# EAGLE schematic Stepper Driver v2 (EAGLE 5.02)
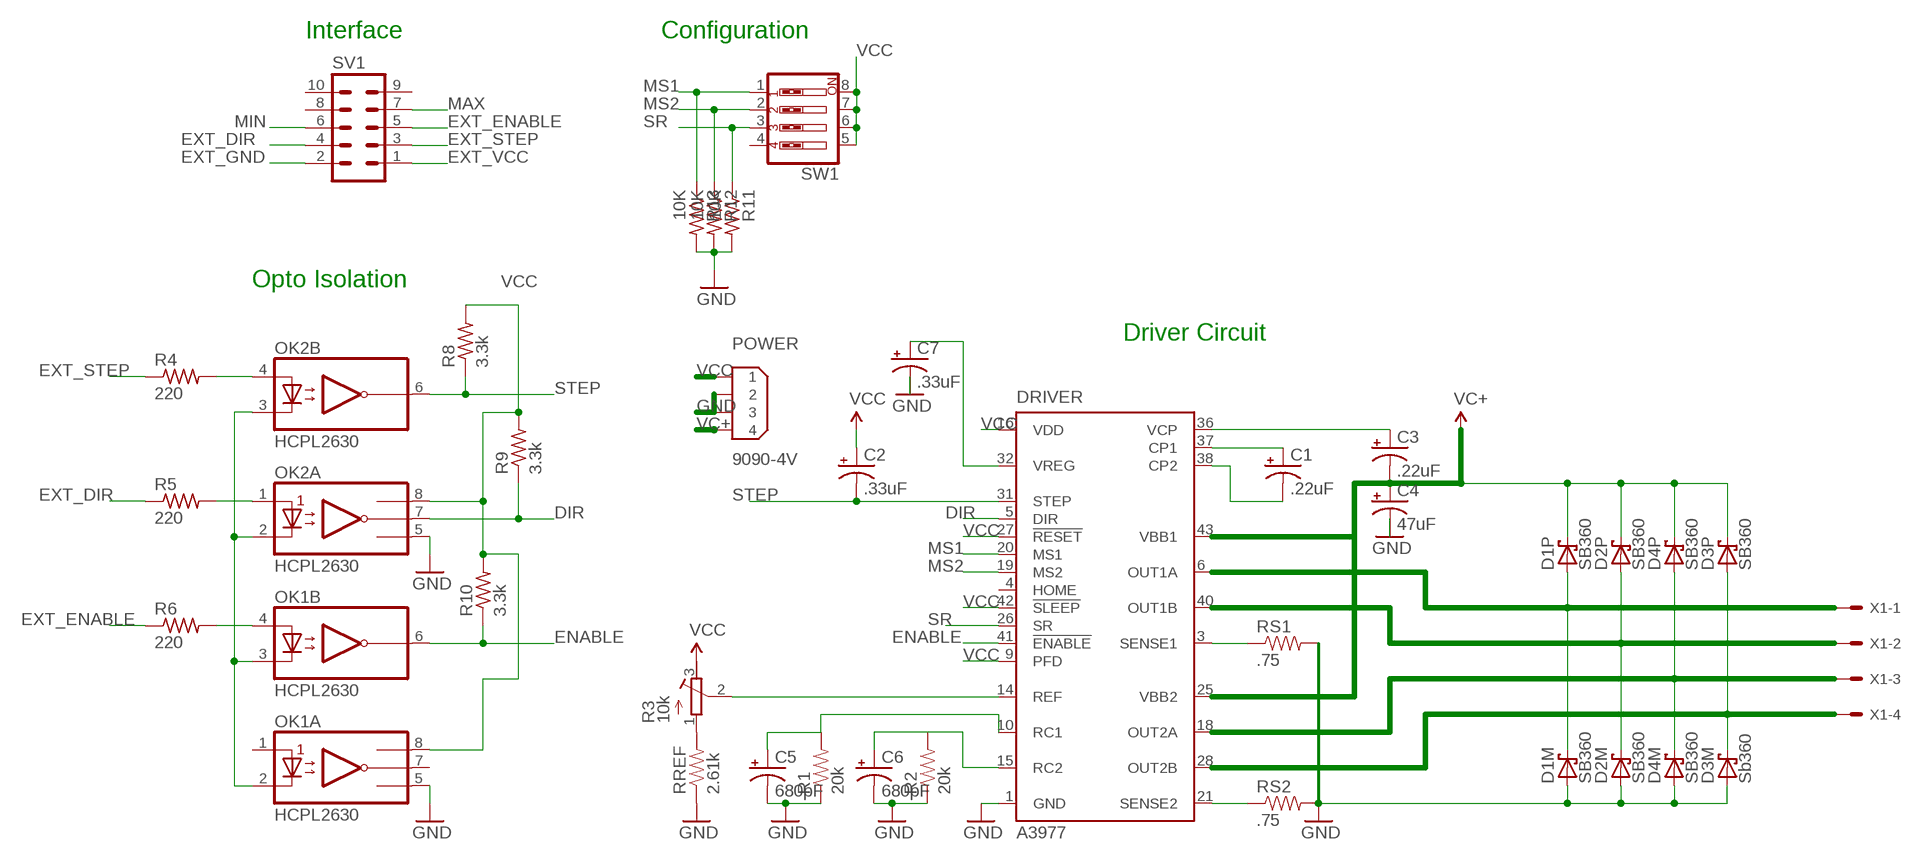
[diagram p0: schematic, sheet 1]

## Parts
C1  .22uF  CAP_POLPTH2  [CPOL-RADIAL-10UF-25V]
C2  .33uF  CAP_POLPTH2  [CPOL-RADIAL-10UF-25V]
C3  .22uF  CAP_POLPTH2  [CPOL-RADIAL-10UF-25V]
C4  47uF  CAP_POLPTH1  [CPOL-RADIAL-100UF-25V]
C5  680pF  CAP_POLPTH2  [CPOL-RADIAL-10UF-25V]
C6  680pF  CAP_POLPTH2  [CPOL-RADIAL-10UF-25V]
C7  .33uF  CAP_POLPTH2  [CPOL-RADIAL-10UF-25V]
D1M  SB360  SCHOTTKY-DIODECB429-15  [CB429-15]
D1P  SB360  SCHOTTKY-DIODECB429-15  [CB429-15]
D2M  SB360  SCHOTTKY-DIODECB429-15  [CB429-15]
D2P  SB360  SCHOTTKY-DIODECB429-15  [CB429-15]
D3M  Sb360  SCHOTTKY-DIODECB429-15  [CB429-15]
D3P  SB360  SCHOTTKY-DIODECB429-15  [CB429-15]
D4M  SB360  SCHOTTKY-DIODECB429-15  [CB429-15]
D4P  SB360  SCHOTTKY-DIODECB429-15  [CB429-15]
DRIVER  A3977  [PLCC44]
OK1  HCPL2630  [DIL08]
OK2  HCPL2630  [DIL08]
POWER  9090-4V  [9090-4V]
R1  20k  RESISTORPTH1  [AXIAL-0.3]
R2  20k  RESISTORPTH1  [AXIAL-0.3]
R3  10k  R-TRIMM3339P  [RTRIM3339P]
R4  220  R-US_0207/2V  [0207/2V]
R5  220  R-US_0207/2V  [0207/2V]
R6  220  R-US_0207/2V  [0207/2V]
R8  3.3k  R-US_0207/2V  [0207/2V]
R9  3.3k  R-US_0207/2V  [0207/2V]
R10  3.3k  R-US_0207/2V  [0207/2V]
R11  10K  R-US_0207/7  [0207/7]
R12  10K  R-US_0207/7  [0207/7]
R13  10K  R-US_0207/7  [0207/7]
RREF  2.61k  RESISTORPTH1  [AXIAL-0.3]
RS1  .75  RESISTORPTH1  [AXIAL-0.3]
RS2  .75  RESISTORPTH1  [AXIAL-0.3]
SV1  ML10  [ML10]
SW1  SW_DIP-4  [EDG-04]
X1  KK-156-4  [KK-156-4]

## Nets
DIR: DRIVER.5(DIR) OK2.7(A:VO1) R9.1
ENABLE: DRIVER.41(!ENABLE) OK1.6(B:VO2) R10.1
EXT_DIR: R5.1 SV1.4
EXT_ENABLE: R6.1 SV1.5
EXT_GND: SV1.2
EXT_STEP: R4.1 SV1.3
EXT_VCC: SV1.1
GND: C4.2(-) C5.2(-) C6.2(-) C7.2(-) D1M.A D2M.A D3M.A D4M.A DRIVER.1(GND) OK1.5(A:GND) OK2.5(A:GND) POWER.2 POWER.3 R1.P$1 R2.P$1 R11.2 R12.2 R13.2 RREF.P$1 RS1.P$2 RS2.P$2
MAX: SV1.7
MIN: SV1.6
MS1: DRIVER.20(MS1) R13.1 SW1.1
MS2: DRIVER.19(MS2) R12.1 SW1.2
N$1: C7.1(+) DRIVER.32(VREG)
N$2: DRIVER.21(SENSE2) RS2.P$1
N$3: DRIVER.3(SENSE1) RS1.P$1
N$4 [Power]: C3.1(+) DRIVER.36(VCP)
N$5: C1.1(+) DRIVER.37(CP1)
N$6: C1.2(-) DRIVER.38(CP2)
N$7: C5.1(+) DRIVER.10(RC1) R1.P$2
N$9: R3.1(E) RREF.P$2
N$10: OK1.2(A:C1) OK1.3(B:C2) OK2.2(A:C1) OK2.3(B:C2)
N$11: C6.1(+) DRIVER.15(RC2) R2.P$2
N$12: OK2.4(B:A2) R4.2
N$13: DRIVER.14(REF) R3.2(S)
N$15: OK2.1(A:A1) R5.2
N$16 [Power]: D1M.C D1P.A DRIVER.6(OUT1A) X1.1
N$18: OK1.4(B:A2) R6.2
N$19 [Power]: D3M.C D3P.A DRIVER.28(OUT2B) X1.4
N$25: D4M.C D4P.A DRIVER.18(OUT2A) X1.3
N$28 [Power]: D2M.C D2P.A DRIVER.40(OUT1B) X1.2
SR: DRIVER.26(SR) R11.1 SW1.3
STEP: C2.2(-) DRIVER.31(STEP) OK2.6(B:VO2) R8.1
VC+ [Power]: C3.2(-) C4.1(+) D1P.C D2P.C D3P.C D4P.C DRIVER.25(VBB2) DRIVER.43(VBB1) POWER.4
VCC: C2.1(+) DRIVER.9(PFD) DRIVER.16(VDD) DRIVER.27(!RESET) DRIVER.42(!SLEEP) OK1.8(A:VCC) OK2.8(A:VCC) POWER.1 R3.3(A) R8.2 R9.2 R10.2 SW1.5 SW1.6 SW1.7 SW1.8
Unconnected: DRIVER.4(HOME) OK1.1(A:A1) OK1.7(A:VO1) SV1.8 SV1.9 SV1.10 SW1.4

## Notes on the sheet
- Interface | Configuration
- Opto Isolation
- Driver Circuit

## Power pins joined to a net without a drawn wire
GND: DRIVER.2(GND) DRIVER.11(GND) DRIVER.12(GND) DRIVER.13(GND) DRIVER.22(GND) DRIVER.23(GND) DRIVER.24(GND) DRIVER.33(GND) DRIVER.34(GND) DRIVER.35(GND) DRIVER.44(GND)

## Library data of the parts
C1-C7 = SparkFunEagle-6-6-07:CAP_POL: Capacitor Polarized These are standard SMD and PTH capacitors. Normally 10uF, 47uF, and 100uF in electrolytic and tantalum varieties. Always verify the external diameter of the through hole cap, it varies with capacity, voltage, and manufacturer. The EIA devices should be standard.
D1M D1P D2M D2P D3M D3P D4M D4P = diode:SCHOTTKY-DIODE: Schottky Diode
DRIVER = linear:A3977: MICROSTEPPING DMOS DRIVER WITH TRANSLATOR Source: http://allegromicro.com/datafile/3977.pdf
OK1 OK2 = optocoupler:HCPL2630: HEWLETT PACKARD OPTO COUPLER
POWER = con-thomas-betts:9090-4: Disk Drive Power four position Source: Thomas & Betts Electronic Interconnects Eiropean Edition 1998
R1 R2 RREF RS1 RS2 = SparkFunEagle-6-6-07:RESISTOR: Resistor Basic schematic elements and footprints for 0603, 1206, and PTH 1/10th watt (small) resistors.
R3 = rcl:R-TRIMM: Trimm resistor
R4-R6 R8-R13 = rcl:R-US_: RESISTOR, American symbol
SV1 = con-harting-ml:ML10: HARTING
SW1 = special:SW_DIP-4: DIP SWITCH
X1 = con-molex:KK-156-4: KK 156 HEADER Source: http://www.molex.com/pdm_docs/sd/026604100_sd.pdf

## Net classes
1 Power: width 1.016 mm, clearance 0.508 mm